# Altium schematic sheet protections_1.SchDoc
size 420 x 297 mm; SheetNumber: 3
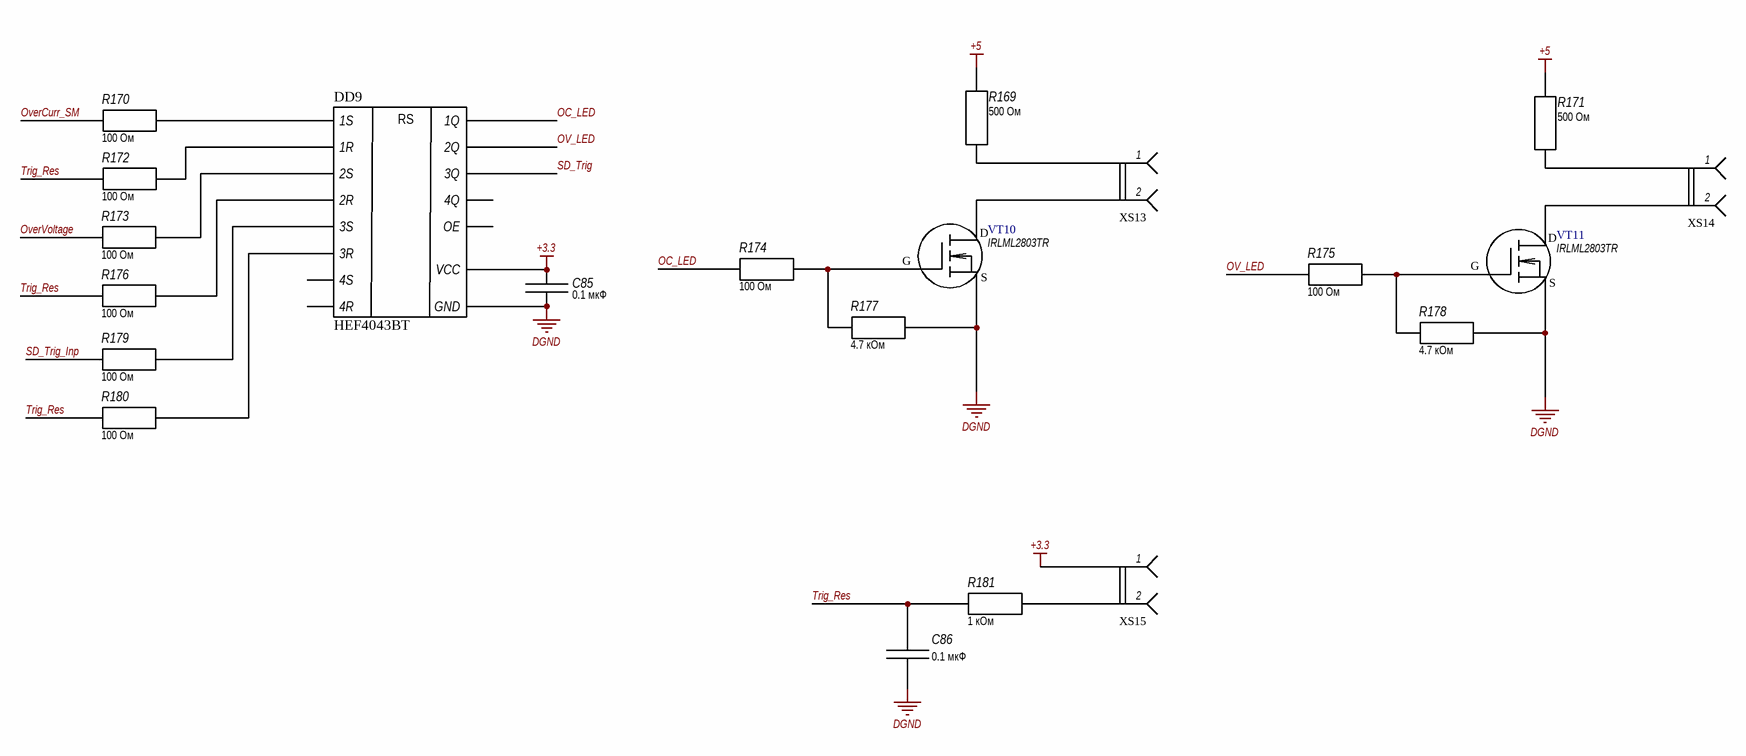
[diagram p0: protections_1.SchDoc]

## Parts
C85  value 0.1 мкФ  [CC0603]  (hidden comment: Capacitor)
C86  value 0.1 мкФ  [CC0603]  (hidden comment: Capacitor)
DD9  HEF4043BT  [SO16]
R169  value 500 Ом  [RC1206]  (hidden comment: Resistor)
R170  value 100 Ом  [RC0603]  (hidden comment: Resistor)
R171  value 500 Ом  [RC1206]  (hidden comment: Resistor)
R172  value 100 Ом  [RC0603]  (hidden comment: Resistor)
R173  value 100 Ом  [RC0603]  (hidden comment: Resistor)
R174  value 100 Ом  [RC0603]  (hidden comment: Resistor)
R175  value 100 Ом  [RC0603]  (hidden comment: Resistor)
R176  value 100 Ом  [RC0603]  (hidden comment: Resistor)
R177  value 4.7 кОм  [RC0603]  (hidden comment: Resistor)
R178  value 4.7 кОм  [RC0603]  (hidden comment: Resistor)
R179  value 100 Ом  [RC0603]  (hidden comment: Resistor)
R180  value 100 Ом  [RC0603]  (hidden comment: Resistor)
R181  value 1 кОм  [RC0603]  (hidden comment: Resistor)
VT10  IRLML2803TR  [SOT-23-3]
VT11  IRLML2803TR  [SOT-23-3]
XS13  JST-Male-2  [JST-2]  (value not drawn)
XS14  JST-Male-2  [JST-2]  (value not drawn)
XS15  JST-Male-2  [JST-2]  (value not drawn)

## Nets
+3.3: C85.2 DD9.16(VCC) XS15.1
+5: R169.1 R171.1
DGND: C85.1 C86.1 DD9.8(GND) R177.1 R178.1 VT10.S VT11.S
OC_LED: DD9.2(1Q) R174.2
OV_LED: DD9.9(2Q) R175.2
OverCurr_SM: R170.2
OverVoltage: R173.2
SD_Trig: DD9.10(3Q)
SD_Trig_Inp: R179.2
Trig_Res: C86.2 R172.2 R176.2 R180.2 R181.1
NetDD9_3: DD9.3(1R) R172.1
NetDD9_4: DD9.4(1S) R170.1
NetDD9_6: DD9.6(2S) R173.1
NetDD9_7: DD9.7(2R) R176.1
NetDD9_11: DD9.11(3R) R180.1
NetDD9_12: DD9.12(3S) R179.1
NetR169_2: R169.2 XS13.1
NetR171_2: R171.2 XS14.1
NetR174_1: R174.1 R177.2 VT10.G
NetR175_1: R175.1 R178.2 VT11.G
NetR181_2: R181.2 XS15.2
NetVT10_D: VT10.D XS13.2
NetVT11_D: VT11.D XS14.2

Not connected (* = marked no-connect by the designer): DD9 1(4Q) 5(OE) 14(4S) 15(4R)

## Notes on the sheet
- Подп. и дата
- Инв. № дубл.
- Взам. инв. №
- Инв. № подл.
- Изм.
- Лист
- № докум.
- Подп.
- Дата
- Форма 2а ГОСТ 2.104-2006
- Копировал
- Формат А3
- (in symbol HEF4043BT) RS

## Library data of the parts
C85 = Capacitor: Voltage: 16В; ComponentLink1Description: Product link; ComponentLink1URL: *; Name: CC0603; GOST_Name_1: =Name; GOST_Name_2: 16В; GOST_Name_3: 0.1 мкФ; GOST_Name_0: -
C86 = Capacitor: Voltage: 50 В; ComponentLink1Description: Product link; ComponentLink1URL: *; Name: CC0603; GOST_Name_1: =Name; GOST_Name_2: 50 В; GOST_Name_3: 0.1 мкФ; GOST_Name_0: -
DD9 = HEF4043BT: Триггер RS-типа х 4 [SOIC-16]; Name: HEF4043BT, ф Nexperia B.V.; ComponentLink1Description: Product link; ComponentLink1URL: https://www.chipdip.ru/product/hef4043bt-652-nexperia
R169 R171 = Resistor: Power: 250 мВт; ComponentLink1Description: Product link; ComponentLink1URL: *; Name: RC1206; GOST_Name_1: =Name; GOST_Name_2: 250 мВт; GOST_Name_3: 500 Ом; GOST_Name_0: -
R170 R172-R181 = Resistor: Power: 100 мВт; ComponentLink1Description: Product link; ComponentLink1URL: *; Name: RC0603; GOST_Name_1: =Name; GOST_Name_2: 100 мВт; GOST_Name_0: -
  R170 R172-R176 R179 R180: GOST_Name_3: 100 Ом
  R177 R178: GOST_Name_3: 4.7 кОм
  R181: GOST_Name_3: 1 кОм
VT10 VT11 = N-MOSFET: pin to pad: D>3 G>1 S>2; GOST_Name_1: IRLML2803TR; ComponentLink1Description: Product link; ComponentLink1URL: https://www.chipdip.ru/product/irlml2803tr-umw?utm_source=direct&utm_medium=cpc&position_type=premium|k50id|010000005534644_5534644|cid|108406362|gid|5417216457|aid|15932497800|src|search_none&utm_campaign=Y_dinamicheskaya&utm_content=text1_ya&utm_term=&yclid=717148778588012543
XS13-XS15 = JST-Male-2: Name: JST-2.54 x2; GOST_Name_1: JST-2.54 x2